# EAGLE board Yantronix_ECG_Base (EAGLE 5.10), part 1 of 2
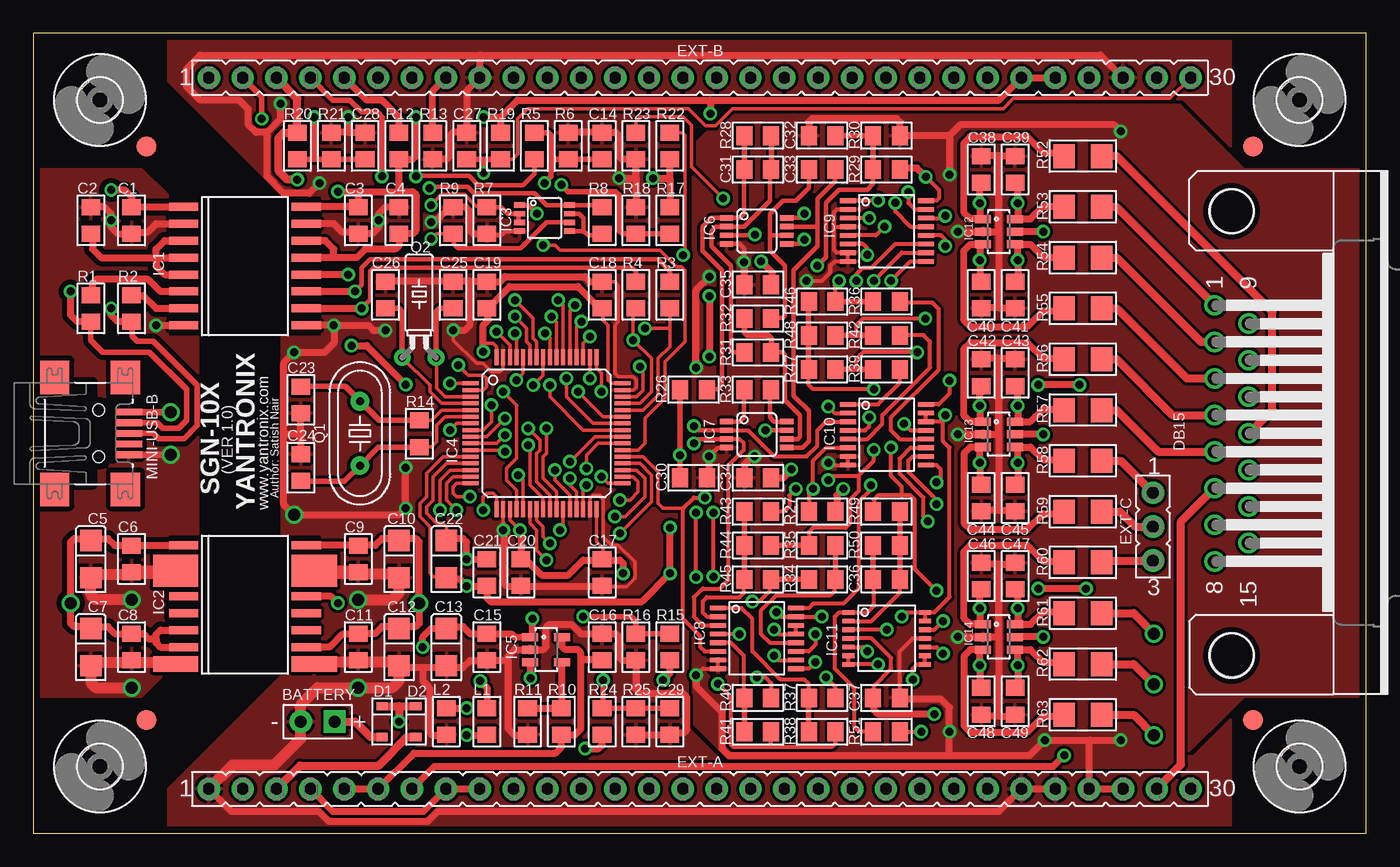
[diagram p2: board, top side]
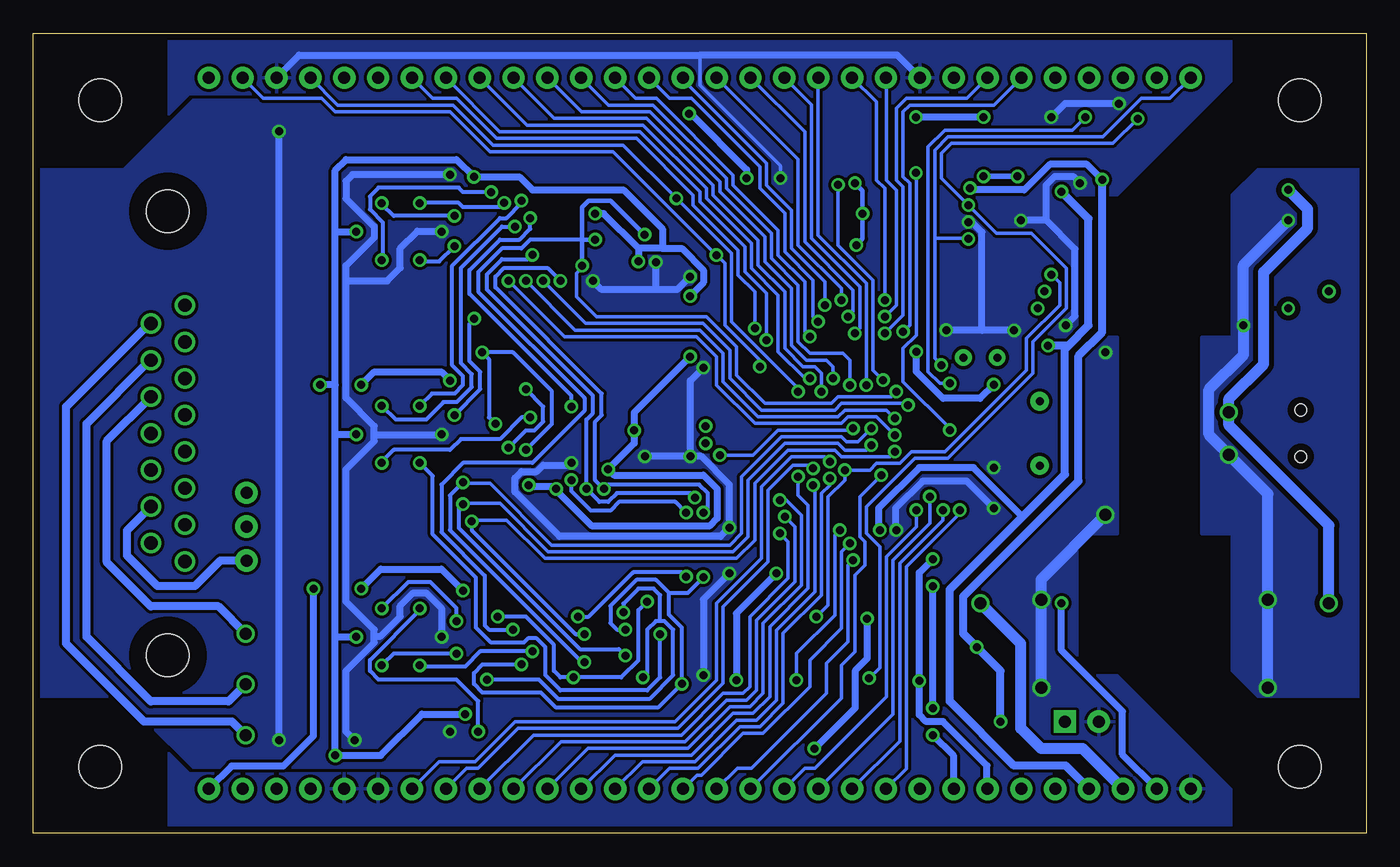
[diagram p3: board, bottom side, seen from below]

Size 100 x 60 mm. Coordinates in mm from the lower left corner, seen from the top.
Outline: 0,0 100,0 100,60 0,60 0,0
Copper layers (1*16): Top 0.035mm / dielectric 1.5mm / Bottom 0.035mm
Design rules "default *": minimum track width 10mil, minimum drill 0.6mm, track to track 9mil, track to pad 8mil, pad to pad 7mil, via to via 9mil, smd to smd 8mil, copper to edge 20mil, drill to drill 8mil, minimum pad ring 10mil, minimum via ring 8mil, stop-mask expansion 4mil, vias tented up to drill 0mil, thermal gap 10mil

## Footprints (pad centres in the part's own frame; a part is rotated, then mirrored left to right if it is on the bottom)
BATTERY = drill 0.9 pad 1.676 square: + 0,1.27 | drill 0.9 pad 1.676 round: - 0,-1.27
0805 = smd 1.2 x 1.4: 1 -1,0; 2 1,0
EIA3216 = smd 1.6 x 1.6: A 1.4,0; C -1.4,0
SOD-323 = smd 0.63 x 0.83: A 1.15,0; K -1.15,0
F15H = drill 1 pad 1.524 round: 1 -9.601,-1.27; 2 -6.858,-1.27; 3 -4.115,-1.27; 4 -1.372,-1.27; 5 1.372,-1.27; 6 4.115,-1.27; 7 6.858,-1.27; 8 9.601,-1.27; 9 -8.23,1.27; 10 -5.486,1.27; 11 -2.743,1.27; 12 0,1.27; 13 2.743,1.27; 14 5.486,1.27; 15 8.23,1.27 | hole 3.2: -16.662,0; 16.662,0
FE30 = drill 0.9 pad 1.676 round: 1 -36.83,0; 2 -34.29,0; 3 -31.75,0; 4 -29.21,0; 5 -26.67,0; 6 -24.13,0; 7 -21.59,0; 8 -19.05,0; 9 -16.51,0; 10 -13.97,0; 11 -11.43,0; 12 -8.89,0; 13 -6.35,0; 14 -3.81,0; 15 -1.27,0; 16 1.27,0; 17 3.81,0; 18 6.35,0; 19 8.89,0; 20 11.43,0; 21 13.97,0; 22 16.51,0; 23 19.05,0; 24 21.59,0; 25 24.13,0; 26 26.67,0; 27 29.21,0; 28 31.75,0; 29 34.29,0; 30 36.83,0
FE03 = drill 0.9 pad 1.676 round: 1 -2.54,0; 2 0,0; 3 2.54,0
3,2 = hole 3.2: 0,0
SO-16W = smd 0.6 x 2.2: 1 -4.445,-4.6; 2 -3.175,-4.6; 3 -1.905,-4.6; 4 -0.635,-4.6; 5 0.635,-4.6; 6 1.905,-4.6; 7 3.175,-4.6; 8 4.445,-4.6; 9 4.445,4.6; 10 3.175,4.6; 11 1.905,4.6; 12 0.635,4.6; 13 -0.635,4.6; 14 -1.905,4.6; 15 -3.175,4.6; 16 -4.445,4.6
RW-16 = smd 0.6 x 2.2: 1 -4.445,-4.6; 4 -0.635,-4.6; 5 0.635,-4.6; 6 1.905,-4.6; 7 3.175,-4.6; 10 3.175,4.6; 11 1.905,4.6; 12 0.635,4.6; 13 -0.635,4.6; 16 -4.445,4.6 | smd 2.4 x 3.4: 2 -2.54,-5.2; 15 -2.54,5.2 | smd 1.13 x 3.4: 8 4.445,-5.2; 9 4.445,5.2
DCT_R-PDSO-G8 = smd 0.4 x 0.8: 1 -0.975,-1.875; 2 -0.325,-1.875; 3 0.325,-1.875; 4 0.975,-1.875; 5 0.975,1.875; 6 0.325,1.875; 7 -0.325,1.875; 8 -0.975,1.875
TQFP64 = smd 1.2 x 0.3: 1 -5.7,3.75; 2 -5.7,3.25; 3 -5.7,2.75; 4 -5.7,2.25; 5 -5.7,1.75; 6 -5.7,1.25; 7 -5.7,0.75; 8 -5.7,0.25; 9 -5.7,-0.25; 10 -5.7,-0.75; 11 -5.7,-1.25; 12 -5.7,-1.75; 13 -5.7,-2.25; 14 -5.7,-2.75; 15 -5.7,-3.25; 16 -5.7,-3.75; 33 5.7,-3.75; 34 5.7,-3.25; 35 5.7,-2.75; 36 5.7,-2.25; 37 5.7,-1.75; 38 5.7,-1.25; 39 5.7,-0.75; 40 5.7,-0.25; 41 5.7,0.25; 42 5.7,0.75; 43 5.7,1.25; 44 5.7,1.75; 45 5.7,2.25; 46 5.7,2.75; 47 5.7,3.25; 48 5.7,3.75 | smd 0.3 x 1.2: 17 -3.75,-5.7; 18 -3.25,-5.7; 19 -2.75,-5.7; 20 -2.25,-5.7; 21 -1.75,-5.7; 22 -1.25,-5.7; 23 -0.75,-5.7; 24 -0.25,-5.7; 25 0.25,-5.7; 26 0.75,-5.7; 27 1.25,-5.7; 28 1.75,-5.7; 29 2.25,-5.7; 30 2.75,-5.7; 31 3.25,-5.7; 32 3.75,-5.7; 49 3.75,5.7; 50 3.25,5.7; 51 2.75,5.7; 52 2.25,5.7; 53 1.75,5.7; 54 1.25,5.7; 55 0.75,5.7; 56 0.25,5.7; 57 -0.25,5.7; 58 -0.75,5.7; 59 -1.25,5.7; 60 -1.75,5.7; 61 -2.25,5.7; 62 -2.75,5.7; 63 -3.25,5.7; 64 -3.75,5.7
SOT23-5 = smd 0.6 x 1.2: 1 -0.95,-1.2; 2 0,-1.2; 3 0.95,-1.2; 4 0.95,1.2; 5 -0.95,1.2
MSOP08 = smd 0.4 x 1: 1 -0.976,-2.263; 2 -0.326,-2.263; 3 0.324,-2.263; 4 0.974,-2.263; 5 0.974,2.262; 6 0.324,2.262; 7 -0.326,2.262; 8 -0.976,2.262
TSSOP16 = smd 0.35 x 1.2: 1 -2.275,-2.925; 2 -1.625,-2.925; 3 -0.975,-2.925; 4 -0.325,-2.925; 5 0.325,-2.925; 6 0.975,-2.925; 7 1.625,-2.925; 8 2.275,-2.925; 9 2.275,2.925; 10 1.625,2.925; 11 0.975,2.925; 12 0.325,2.925; 13 -0.325,2.925; 14 -0.975,2.925; 15 -1.625,2.925; 16 -2.275,2.925
TSSOP14 = smd 0.9 x 0.35: 1 -2.875,1.95; 2 -2.875,1.3; 3 -2.875,0.65; 4 -2.875,0; 5 -2.875,-0.65; 6 -2.875,-1.3; 7 -2.875,-1.95; 8 2.875,-1.95; 9 2.875,-1.3; 10 2.875,-0.65; 11 2.875,0; 12 2.875,0.65; 13 2.875,1.3; 14 2.875,1.95
SOT23-6 = smd 0.6 x 1.2: 1 -0.95,-1.2; 2 0,-1.2; 3 0.95,-1.2; 4 0.95,1.2; 5 0,1.2; 6 -0.95,1.2
FIDUCIAL-1.5X3 = smd 1.5 x 1.5: 1 0,0
UX60-MB-5ST = smd 2 x 0.5: 1 2.25,1.6; 2 2.25,0.8; 3 2.25,0; 4 2.25,-0.8; 5 2.25,-1.6 | smd 2.2 x 2.5: M1 -3.3,-4.2; M2 -3.3,4.2; M3 2,4.2; M4 2,-4.2 | hole 0.9: 0,-1.75; 0,1.75
HC49/S = drill 0.6 pad 1.422 round: 1 -2.413,0; 2 2.413,0
TC26H = drill 0.6 pad 1.27 round: 1 -1.27,0; 2 1.27,0
1206 = smd 1.6 x 1.8: 1 -1.4,0; 2 1.4,0

## Placement (x,y rotation side)
BATTERY  BATTERY  [BATTERY]  21.34,8.38 270 top
C1  0.1uF  [0805]  7.37,45.97 270 top
C2  0.1uF  [0805]  4.32,45.97 270 top
C3  0.1uF  [0805]  24.38,45.97 270 top
C4  0.1uF  [0805]  27.43,45.97 270 top
C5  10uF  [EIA3216]  4.32,20.57 90 top
C6  0.1uF  [0805]  7.37,20.57 270 top
C7  10uF  [EIA3216]  4.32,13.97 90 top
C8  0.1uF  [0805]  7.37,13.97 270 top
C9  0.1uF  [0805]  24.38,20.57 270 top
C10  10uF  [EIA3216]  27.43,20.57 90 top
C11  0.1uF  [0805]  24.38,13.97 270 top
C12  10uF  [EIA3216]  27.43,13.97 90 top
C13  10uF  [EIA3216]  30.99,13.97 90 top
C14  0.1uF  [0805]  42.67,51.56 270 top
C15  1uF  [0805]  34.04,13.97 270 top
C16  1uF  [0805]  42.67,13.97 270 top
C17  0.1uF  [0805]  42.67,19.56 270 top
C18  0.1uF  [0805]  42.67,40.39 270 top
C19  0.1uF  [0805]  34.04,40.39 270 top
C20  0.1uF  [0805]  36.58,19.56 270 top
C21  0.1uF  [0805]  34.04,19.56 270 top
C22  10uF  [EIA3216]  30.99,20.57 90 top
C23  27pF  [0805]  20.07,32.51 270 top
C24  27pF  [0805]  20.07,27.43 270 top
C25  6.8pF  [0805]  31.5,40.39 270 top
C26  6.8pF  [0805]  26.42,40.39 270 top
C27  0.1uF  [0805]  32.51,51.56 270 top
C28  0.1uF  [0805]  24.89,51.56 270 top
C29  0.1uF  [0805]  47.75,8.38 270 top
C30  0.1uF  [0805]  49.53,26.67 0 top
C31  1nF  [0805]  54.36,49.78 0 top
C32  0.1uF  [0805]  59.18,52.32 0 top
C33  0.1uF  [0805]  59.18,49.78 0 top
C34  0.1uF  [0805]  54.36,26.67 0 top
C35  0.1uF  [0805]  54.36,41.15 0 top
C36  47pF  [0805]  64.01,19.05 0 top
C37  0.1uF  [0805]  64.01,10.16 0 top
C38  0.1uF  [0805]  71.12,49.78 270 top
C39  0.1uF  [0805]  73.66,49.78 270 top
C40  0.1uF  [0805]  71.12,40.39 90 top
C41  0.1uF  [0805]  73.66,40.39 90 top
C42  0.1uF  [0805]  71.12,34.54 270 top
C43  0.1uF  [0805]  73.66,34.54 270 top
C44  0.1uF  [0805]  71.12,25.15 90 top
C45  0.1uF  [0805]  73.66,25.15 90 top
C46  0.1uF  [0805]  71.12,19.3 270 top
C47  0.1uF  [0805]  73.66,19.3 270 top
C48  0.1uF  [0805]  71.12,9.91 90 top
C49  0.1uF  [0805]  73.66,9.91 90 top
D1  BAT60J  [SOD-323]  26.16,8.38 270 top
D2  BAT60J  [SOD-323]  28.7,8.38 270 top
DB15  F15H  [F15H]  89.9,30 270 top
EXT-A  FE30-1  [FE30]  50,3.33 0 top
EXT-B  FE30-1  [FE30]  50,56.67 0 top
EXT-C  FE03-1  [FE03]  84,23 270 top
H1  MOUNT-HOLE3.2  [3,2]  5,5 0 top
H2  MOUNT-HOLE3.2  [3,2]  95,5 0 top
H3  MOUNT-HOLE3.2  [3,2]  95,55 0 top
H4  MOUNT-HOLE3.2  [3,2]  5,55 0 top
IC1  ADUM4160  [SO-16W]  15.88,42.55 270 top
IC2  ADUM5000  [RW-16]  15.88,17.14 270 top
IC3  SN74LVC2G02  [DCT_R-PDSO-G8]  38.35,46.15 270 top
IC4  STM32F10XRXT6  [TQFP64]  38.5,30 0 top
IC5  ADP123AUJZ  [SOT23-5]  38.48,13.78 270 top
IC6  AD8606RM  [MSOP08]  54.27,45.17 270 top
IC7  AD623RM  [MSOP08]  54.27,29.9 270 top
IC8  74HC4051  [TSSOP16]  54.27,14.62 270 top
IC9  74HC4051  [TSSOP16]  64.03,45.17 270 top
IC10  74HC4051  [TSSOP16]  64.03,29.9 270 top
IC11  AD8608RU  [TSSOP14]  64.03,14.62 0 top
IC12  SP3002-04HTG  [SOT23-6]  72.44,45.12 270 top
IC13  SP3002-04HTG  [SOT23-6]  72.44,29.93 270 top
IC14  SP3002-04HTG  [SOT23-6]  72.44,14.72 270 top
JP1  FIDUCIAL1.5X3  [FIDUCIAL-1.5X3]  8.5,8.5 0 top
JP2  FIDUCIAL1.5X3  [FIDUCIAL-1.5X3]  91.5,8.5 0 top
JP3  FIDUCIAL1.5X3  [FIDUCIAL-1.5X3]  91.5,51.5 0 top
JP4  FIDUCIAL1.5X3  [FIDUCIAL-1.5X3]  8.5,51.5 0 top
L1  Bead  [0805]  34.04,8.38 270 top
L2  Bead  [0805]  30.99,8.38 270 top
MINI-USB-B  MINI-USB-SHIELD-UX60-MB-5ST  [UX60-MB-5ST]  4.91,30 0 top
Q1  8MHz  [HC49/S]  24.5,30 90 top
Q2  32KHz  [TC26H]  28.96,35.69 0 top
R1  24R  [0805]  4.32,39.37 270 top
R2  24R  [0805]  7.37,39.37 270 top
R3  24R  [0805]  47.75,40.39 270 top
R4  24R  [0805]  45.21,40.39 270 top
R5  330R  [0805]  37.59,51.56 270 top
R6  100K  [0805]  40.13,51.56 270 top
R7  100K  [0805]  34.04,45.97 270 top
R8  100K  [0805]  42.67,45.97 270 top
R9  100K  [0805]  31.5,45.97 270 top
R10  100K  [0805]  39.62,8.38 270 top
R11  18K  [0805]  37.08,8.38 270 top
R12  330R  [0805]  27.43,51.56 270 top
R13  330R  [0805]  29.97,51.56 270 top
R14  1M  [0805]  28.96,29.97 270 top
R15  10K  [0805]  47.75,13.97 270 top
R16  10K  [0805]  45.21,13.97 270 top
R17  10K  [0805]  47.75,45.97 270 top
R18  10K  [0805]  45.21,45.97 270 top
R19  100K  [0805]  35.05,51.56 270 top
R20  330K  [0805]  19.81,51.56 270 top
R21  680K  [0805]  22.35,51.56 270 top
R22  10K  [0805]  47.75,51.56 270 top
R23  10K  [0805]  45.21,51.56 270 top
R24  1M  [0805]  42.67,8.38 270 top
R25  1M  [0805]  45.21,8.38 270 top
R26  100R  [0805]  49.53,33.27 0 top
R27  10K  [0805]  59.18,24.13 0 top
R28  1M  [0805]  54.36,52.32 0 top
R29  100K  [0805]  64.01,49.78 0 top
R30  100K  [0805]  64.01,52.32 0 top
R31  5.1K  [0805]  54.36,36.07 0 top
R32  1M  [0805]  54.36,38.61 0 top
R33  24K  [0805]  54.36,33.27 0 top
R34  10K  [0805]  59.18,19.05 0 top
R35  10K  [0805]  59.18,21.59 0 top
R36  10K  [0805]  64.01,39.88 0 top
R37  10K  [0805]  59.18,10.16 0 top
R38  10K  [0805]  59.18,7.62 0 top
R39  10K  [0805]  64.01,34.8 0 top
R40  10K  [0805]  54.36,10.16 0 top
R41  10K  [0805]  54.36,7.62 0 top
R42  10K  [0805]  64.01,37.34 0 top
R43  10K  [0805]  54.36,24.13 0 top
R44  10K  [0805]  54.36,21.59 0 top
R45  10K  [0805]  54.36,19.05 0 top
R46  10K  [0805]  59.18,39.88 0 top
R47  10K  [0805]  59.18,34.8 0 top
R48  10K  [0805]  59.18,37.34 0 top
R49  10K  [0805]  64.01,24.13 0 top
R50  390K  [0805]  64.01,21.59 0 top
R51  100K  [0805]  64.01,7.62 0 top
R52  10K  [1206]  78.74,50.8 0 top
R53  10K  [1206]  78.74,46.99 0 top
R54  10K  [1206]  78.74,43.18 0 top
R55  10K  [1206]  78.74,39.37 0 top
R56  10K  [1206]  78.74,35.56 0 top
R57  10K  [1206]  78.74,31.75 0 top
R58  10K  [1206]  78.74,27.94 0 top
R59  10K  [1206]  78.74,24.13 0 top
R60  10K  [1206]  78.74,20.32 0 top
R61  10K  [1206]  78.74,16.51 0 top
R62  10K  [1206]  78.74,12.7 0 top
R63  10K  [1206]  78.74,8.89 0 top